# Altium schematic sheet GarageDoor ESP DEVKIT V1 ESP-WROOM-32 (30-pin) pinout.SchDoc
size A3
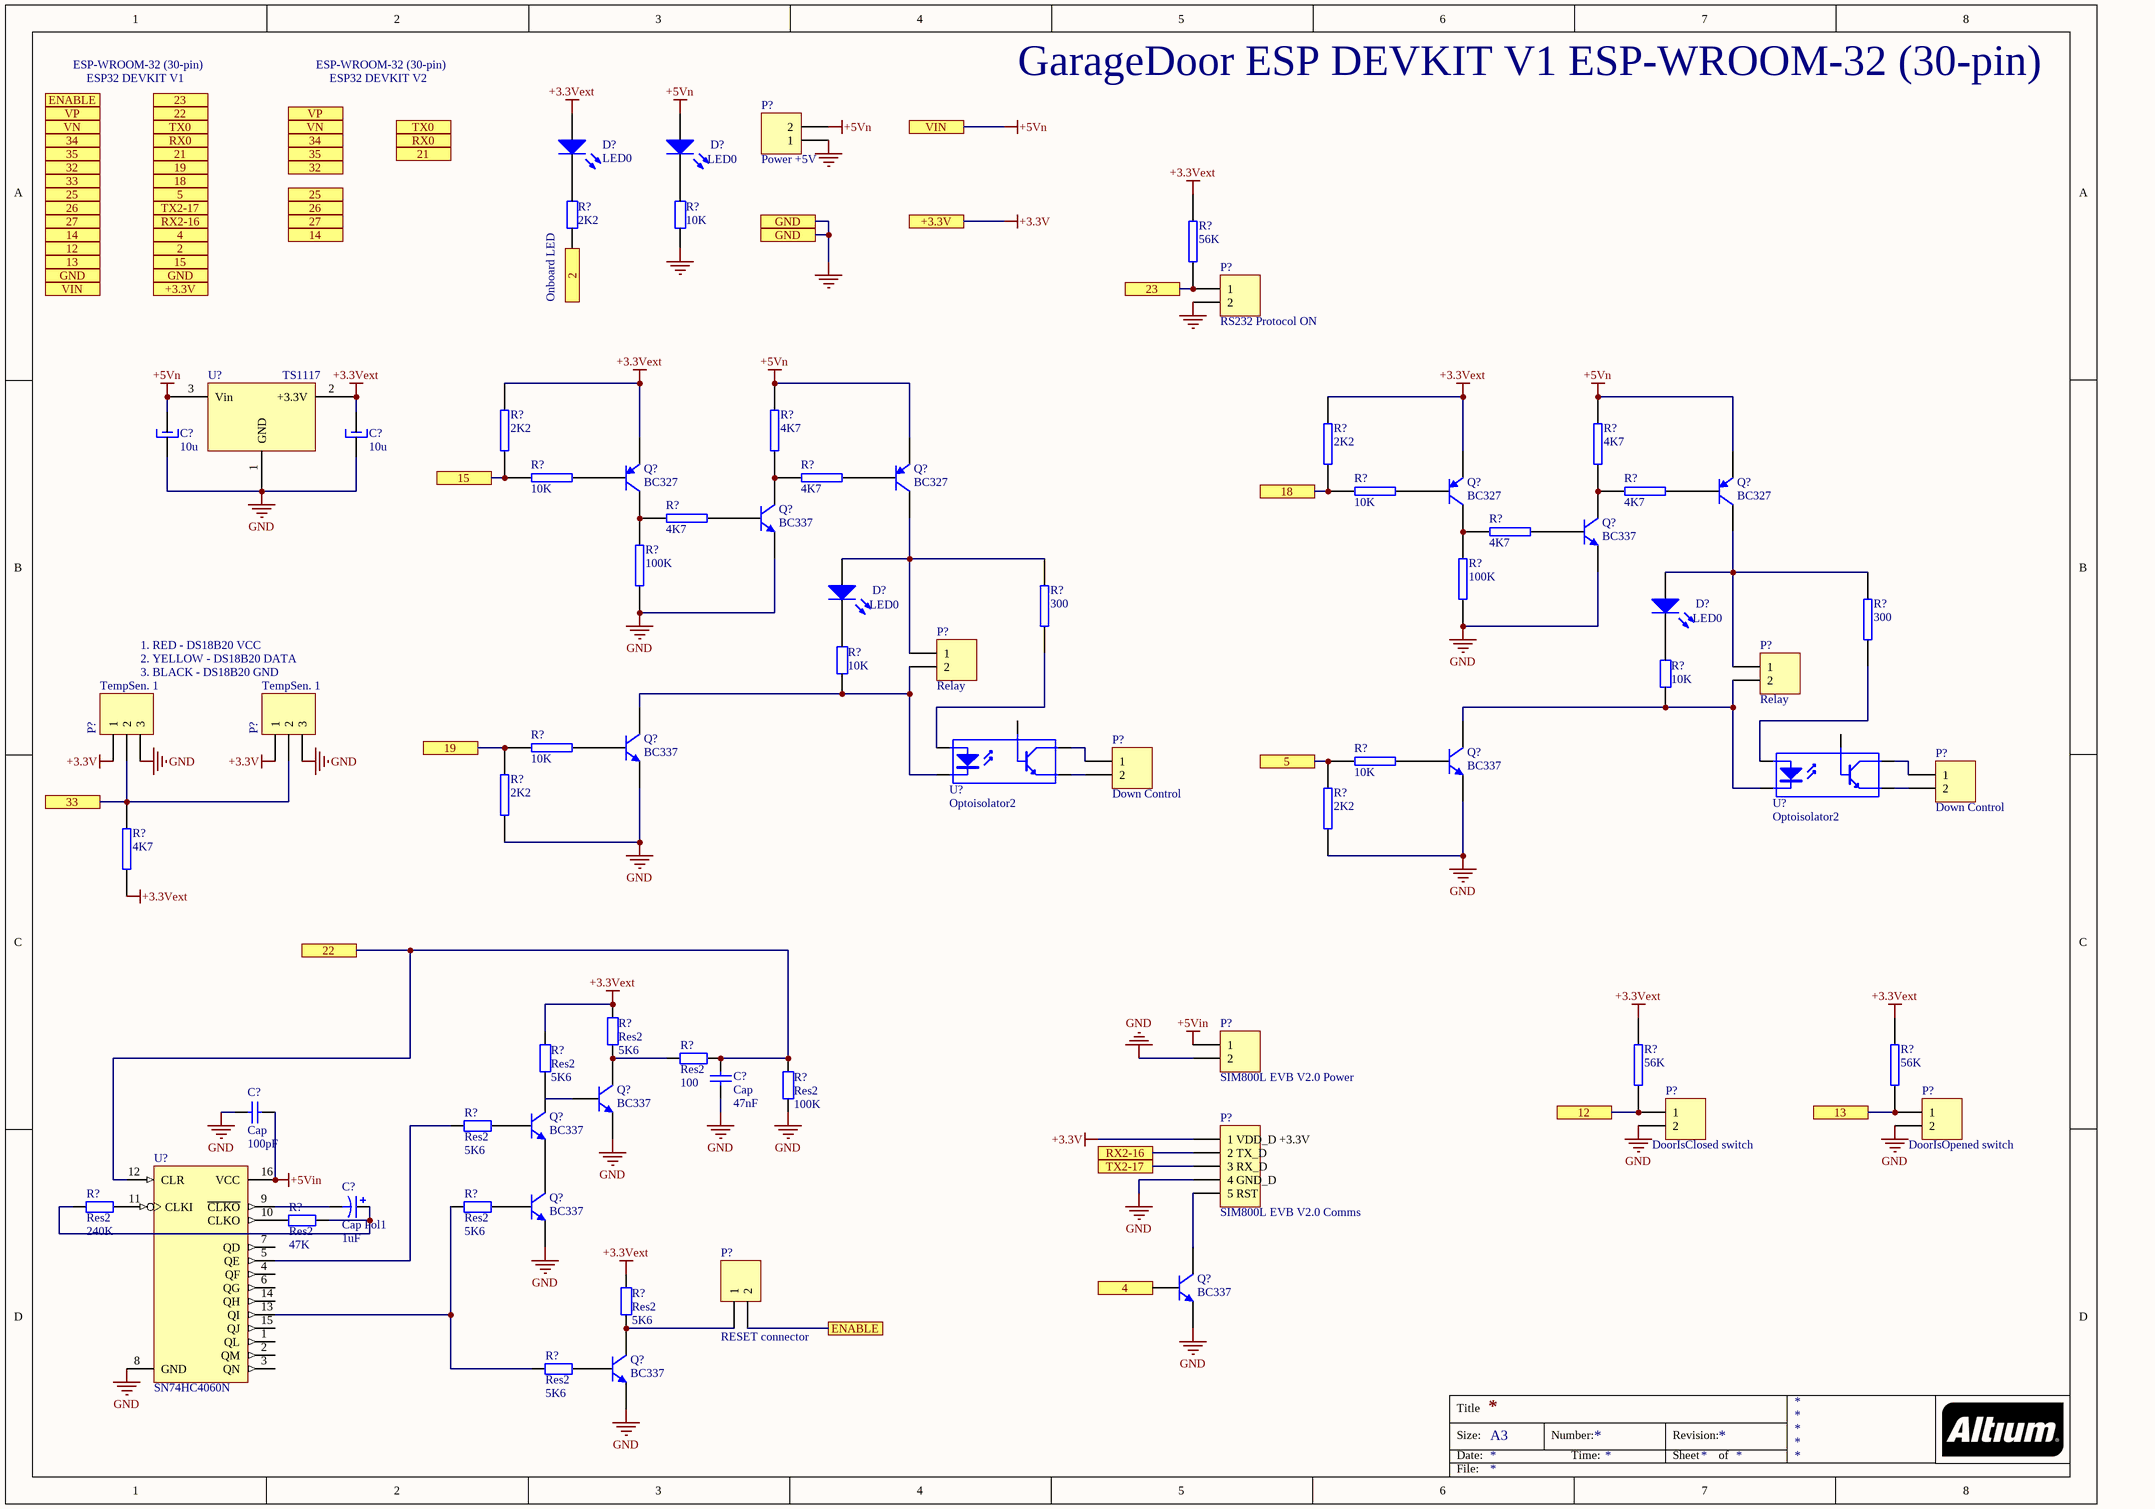
[diagram p0: GarageDoor ESP DEVKIT V1 ESP-WROOM-32 (30-pin) pinout.SchDoc]

## Parts
(Parts that share a designator on the sheet are numbered #1, #2 ... from top to bottom, then left to right.)
C?#1  10u  [Capacitor 10mikro]
C?#2  10u  [Capacitor 10mikro]
C?#3  Cap  value 47nF  [RAD-0.3]
C?#4  Cap  value 100pF  [RAD-0.3]
C?#5  Cap Pol1  value 1uF  [RB7.6-15]
D?#1  LED0  [LED-0]
D?#2  LED0  [LED-0]
D?#3  LED0  [LED-0]
D?#4  LED0  [LED-0]
P?#1  Power +5V  [HDR1X2]
P?#2  RS232 Protocol ON  [HDR1X2]
P?#3  Relay  [HDR1X2]
P?#4  Relay  [HDR1X2]
P?#5  TempSen. 1  [HDR1X3]
P?#6  TempSen. 1  [HDR1X3]
P?#7  Down Control  [HDR1X2]
P?#8  Down Control  [HDR1X2]
P?#9  SIM800L EVB V2.0 Power  [HDR1X2]
P?#10  DoorIsClosed switch  [HDR1X2]
P?#11  DoorIsOpened switch  [HDR1X2]
P?#12  SIM800L EVB V2.0 Comms  [HDR1X5]
P?#13  RESET connector  [HDR1X2]
Q?#1  BC327  [SOT-23B_N]
Q?#2  BC327  [SOT-23B_N]
Q?#3  BC327  [SOT-23B_N]
Q?#4  BC327  [SOT-23B_N]
Q?#5  BC337  [TO-226-AA]
Q?#6  BC337  [TO-226-AA]
Q?#7  BC337  [TO-226-AA]
Q?#8  BC337  [TO-226-AA]
Q?#9  BC337  [TO-226-AA]
Q?#10  BC337  [TO-226-AA]
Q?#11  BC337  [TO-226-AA]
Q?#12  BC337  [TO-226-AA]
Q?#13  BC337  [TO-226-AA]
R?#1  value 2K2  [SMD0805]  (hidden comment: Resistor)
R?#2  value 10K  [SMD0805]  (hidden comment: Resistor)
R?#3  56K  [SMD0805]
R?#4  2K2  [SMD0805]
R?#5  4K7  [SMD0805]
R?#6  10K  [SMD0805]
R?#7  4K7  [SMD0805]
R?#8  2K2  [SMD0805]
R?#9  4K7  [SMD0805]
R?#10  10K  [SMD0805]
R?#11  4K7  [SMD0805]
R?#12  4K7  [SMD0805]
R?#13  4K7  [SMD0805]
R?#14  100K  [SMD0805]
R?#15  300  [SMD0805]
R?#16  100K  [SMD0805]
R?#17  300  [SMD0805]
R?#18  value 10K  [SMD0805]  (hidden comment: Resistor)
R?#19  value 10K  [SMD0805]  (hidden comment: Resistor)
R?#20  10K  [SMD0805]
R?#21  10K  [SMD0805]
R?#22  2K2  [SMD0805]
R?#23  4K7  [SMD0805]
R?#24  2K2  [SMD0805]
R?#25  Res2  value 5K6  [AXIAL-0.4]
R?#26  Res2  value 100  [AXIAL-0.4]
R?#27  Res2  value 5K6  [AXIAL-0.4]
R?#28  56K  [SMD0805]
R?#29  56K  [SMD0805]
R?#30  Res2  value 100K  [AXIAL-0.4]
R?#31  Res2  value 5K6  [AXIAL-0.4]
R?#32  Res2  value 240K  [AXIAL-0.4]
R?#33  Res2  value 5K6  [AXIAL-0.4]
R?#34  Res2  value 47K  [AXIAL-0.4]
R?#35  Res2  value 5K6  [AXIAL-0.4]
R?#36  Res2  value 5K6  [AXIAL-0.4]
U?#1  TS1117  [SOT-223]
U?#2  Optoisolator2  [SOP5(6)]
U?#3  Optoisolator2  [SOP5(6)]
U?#4  SN74HC4060N  [N016]

## Ports
2, 4, 5, 12, 13, 14, 15, 18, 19, 21, 22, 23, 25, 26, 27, 32, 33, 34, 35, +3.3V, ENABLE, GND, RX0, RX2-16, TX0, TX2-17, VIN, VN, VP

## Nets
+3.3V: P?#5.1 P?#6.1 P?#12.1(1_VDD_D_+3.3V) ; port +3.3V
+3.3Vext: C?#2.1 D?#1.1(A) Q?#1.3(E) Q?#3.3(E) R?#3.2 R?#4.2 R?#8.2 R?#23.2 R?#25.2 R?#27.2 R?#28.2 R?#29.2 R?#35.2 U?#1.2(+3.3V)
+3.3VRFID: U?#1.4
+5Vin: C?#4.2 P?#9.1 U?#4.16(VCC)
+5Vn: C?#1.1 D?#2.1(A) P?#1.2 Q?#2.3(E) Q?#4.3(E) R?#5.2 R?#9.2 U?#1.3(Vin) ; port VIN
GND: C?#1.2 C?#2.2 C?#3.1 C?#4.1 P?#1.1 P?#2.2 P?#5.3 P?#6.3 P?#9.2 P?#10.2 P?#11.2 P?#12.4(4_GND_D) Q?#5.3(E) Q?#6.3(E) Q?#7.3(E) Q?#8.3(E) Q?#9.3(E) Q?#11.3(E) Q?#12.3(E) Q?#13.3(E) R?#2.1 R?#14.1 R?#16.1 R?#22.1 R?#24.1 R?#30.1 U?#1.1(GND) U?#4.8(GND) ; port GND
2: R?#1.2 ; port 2
4: Q?#12.2(B) ; port 4
5: R?#21.1 R?#24.2 ; port 5
12: P?#10.1 R?#28.1 ; port 12
13: P?#11.1 R?#29.1 ; port 13
15: R?#4.1 R?#6.1 ; port 15
18: R?#8.1 R?#10.1 ; port 18
19: R?#20.1 R?#22.2 ; port 19
22: C?#3.2 R?#26.2 R?#30.2 U?#4.12(CLR) ; port 22
23: P?#2.1 R?#3.1 ; port 23
33: P?#5.2 P?#6.2 R?#23.1 ; port 33
ENABLE: P?#13.2 ; port ENABLE
RX2-16: P?#12.2(2_TX_D) ; port RX2-16
TX2-17: P?#12.3(3_RX_D) ; port TX2-17
NetC?#5_1: C?#5.1 R?#32.1 R?#34.2
NetC?#5_2: C?#5.2 U?#4.9(~{CLKO})
NetD?#1_2: D?#1.2(K) R?#1.1
NetD?#2_2: D?#2.2(K) R?#2.2
NetD?#3_1: D?#3.1(A) P?#3.1 Q?#2.1(C) R?#15.1
NetD?#3_2: D?#3.2(K) R?#18.2
NetD?#4_1: D?#4.1(A) P?#4.1 Q?#4.1(C) R?#17.1
NetD?#4_2: D?#4.2(K) R?#19.2
NetP?#3_2: P?#3.2 Q?#7.1(C) R?#18.1 U?#2.3(K)
NetP?#4_2: P?#4.2 Q?#8.1(C) R?#19.1 U?#3.3(K)
NetP?#7_1: P?#7.1 U?#2.5(C)
NetP?#7_2: P?#7.2 U?#2.4(E)
NetP?#8_1: P?#8.1 U?#3.5(C)
NetP?#8_2: P?#8.2 U?#3.4(E)
NetP?#12_5: P?#12.5(5_RST) Q?#12.1(C)
NetP?#13_1: P?#13.1 Q?#13.1(C) R?#35.1
NetQ?#1_1: Q?#1.1(C) R?#12.1 R?#14.2
NetQ?#1_2: Q?#1.2(B) R?#6.2
NetQ?#2_2: Q?#2.2(B) R?#7.2
NetQ?#3_1: Q?#3.1(C) R?#13.1 R?#16.2
NetQ?#3_2: Q?#3.2(B) R?#10.2
NetQ?#4_2: Q?#4.2(B) R?#11.2
NetQ?#5_1: Q?#5.1(C) R?#5.1 R?#7.1
NetQ?#5_2: Q?#5.2(B) R?#12.2
NetQ?#6_1: Q?#6.1(C) R?#9.1 R?#11.1
NetQ?#6_2: Q?#6.2(B) R?#13.2
NetQ?#7_2: Q?#7.2(B) R?#20.2
NetQ?#8_2: Q?#8.2(B) R?#21.2
NetQ?#9_1: Q?#9.1(C) R?#25.1 R?#26.1
NetQ?#10_1: Q?#10.1(C) R?#27.1
NetQ?#10_2: Q?#10.2(B) R?#31.2
NetQ?#10_3: Q?#10.3(E) Q?#11.1(C)
NetQ?#11_2: Q?#11.2(B) R?#33.2
NetQ?#13_2: Q?#13.2(B) R?#36.2
NetR?#15_2: R?#15.2 U?#2.1(A)
NetR?#17_2: R?#17.2 U?#3.1(A)
NetR?#31_1: R?#31.1 U?#4.5(QE)
NetR?#32_2: R?#32.2 U?#4.11(CLKI)
NetR?#33_1: R?#33.1 R?#36.1 U?#4.13(QI)
NetR?#34_1: R?#34.1 U?#4.10(CLKO)

Not connected (* = marked no-connect by the designer): Q?#9 2(B); U?#2 6(B); U?#3 6(B); U?#4 1(QL) 2(QM) 3(QN) 4(QF) 6(QG) 7(QD) 14(QH) 15(QJ)

## Notes on the sheet
- ESP-WROOM-32 (30-pin)
- ESP32 DEVKIT V1
- ESP32 DEVKIT V2
- GarageDoor ESP DEVKIT V1 ESP-WROOM-32 (30-pin)
- (near R?#1) Onboard LED
- 1. RED - DS18B20 VCC
- 2. YELLOW - DS18B20 DATA
- 3. BLACK - DS18B20 GND
- Title
- Size:
- Date:
- A3
- Number:
- Time:
- Revision:
- Sheet
- of
- File:

## Library data of the parts
C?#1 C?#2 = Capacitor 10mikro
C?#3 C?#4 = Cap: Capacitor; Published: 8-Jun-2000; LatestRevisionDate: 17-Jul-2002; LatestRevisionNote: Re-released for DXP Platform.; PackageReference: RAD-0.3; Publisher: Altium Limited; PackageDescription: Radial Cap, Thru-Hole; 2 Leads; 0.3 in Pin Spacing
C?#5 = Cap Pol1: Polarized Capacitor (Radial); Published: 8-Jun-2000; LatestRevisionDate: 17-Jul-2002; LatestRevisionNote: Re-released for DXP Platform.; PackageReference: RB7.6-15; Publisher: Altium Limited; PackageDescription: Polarized Capacitor (Radial); 2 Leads
D?#1-D?#4 = LED0: Typical INFRARED GaAs LED; Published: 8-Jun-2000; LatestRevisionDate: 08-Jul-2005; LatestRevisionNote: Mech Layer 1 removed.; PackageReference: LED-0; Publisher: Altium Limited
P?#1-P?#4 P?#7-P?#11 P?#13 = Header 2: Header, 2-Pin; LatestRevisionDate: 17-Jul-2002; LatestRevisionNote: Re-released for DXP Platform.; Publisher: Altium Limited
P?#5 P?#6 = Header 3: Header, 3-Pin; LatestRevisionDate: 17-Jul-2002; LatestRevisionNote: Re-released for DXP Platform.; Publisher: Altium Limited
P?#12 = Header 5: Header, 5-Pin; LatestRevisionDate: 17-Jul-2002; LatestRevisionNote: Re-released for DXP Platform.; Publisher: Altium Limited
Q?#1-Q?#4 = PNP: PNP Bipolar Transistor; Published: 8-Jun-2000; LatestRevisionDate: 29-May-2009; LatestRevisionNote: IPC-7351 Footprint Added.; PackageVersion: Aug-1999; PackageReference: SOT-23B; Publisher: Altium Limited; PackageDescription: 3-Pin SOT-23 Package 0.95 mm Pitch, 2.4 mm Lead Span
Q?#5-Q?#13 = NPN: NPN Bipolar Transistor; Published: 8-Jun-2000; LatestRevisionDate: 17-Jul-2002; LatestRevisionNote: Re-released for DXP Platform.; PackageReference: TO-226-AA; Publisher: Altium Limited; PackageDescription: TO, Flat Index; 3 In-Line, Axial Leads; Body Dia. 4.8mm; Leads 0.55 x 0.51 mm (max); Code_JEDEC: TO-226-AA
R?#1 R?#2 R?#18 R?#19 = Resistor 0.25W
R?#3-R?#17 R?#20-R?#24 R?#28 R?#29 = RES2
R?#25-R?#27 R?#30-R?#36 = Res2: Resistor; Published: 8-Jun-2000; LatestRevisionDate: 17-Jul-2002; LatestRevisionNote: Re-released for DXP Platform.; PackageReference: AXIAL-0.4; Publisher: Altium Limited; PackageDescription: Axial Device, Thru-Hole; 2 Leads; 0.4 in Pin Spacing
U?#2 U?#3 = Optoisolator2: 5 Pin Mini Flat Pack Optocoupler; Published: 24-Mar-1999; LatestRevisionDate: 04-Mar-2005; LatestRevisionNote: PCB Footprint replaced, Sch pins re-numbered.; DatasheetVersion: Apr-2004; PackageReference: SOP5(6); Publisher: Altium Limited; PackageDescription: Small Outline; 6 Leads (1 Absent); Body Width 4.4 mm; Pitch 1.27 mm
U?#4 = SN74HC4060N: 14-Stage Asynchronous Binary Counter and Oscillator; Published: 8-Jun-2000; LatestRevisionDate: 04-Mar-2005; LatestRevisionNote: Stylized 3D Model Added.; DatasheetVersion: May-1997; PackageVersion: Oct-1995; PackageReference: N016; Publisher: Altium Limited; PackageDescription: DIP; 16 Leads; Row Spacing 7.62 mm; Pitch 2.54 mm; Code_JEDEC: MS-001-BB; ComponentLink1Description: Manufacturer Link; ComponentLink1URL: http://www.ti.com/; ComponentLink2Description: Datasheet; ComponentLink2URL: http://www-s.ti.com/sc/ds/sn74hc4060.pdf